# Altium project TEST.PrjPcb
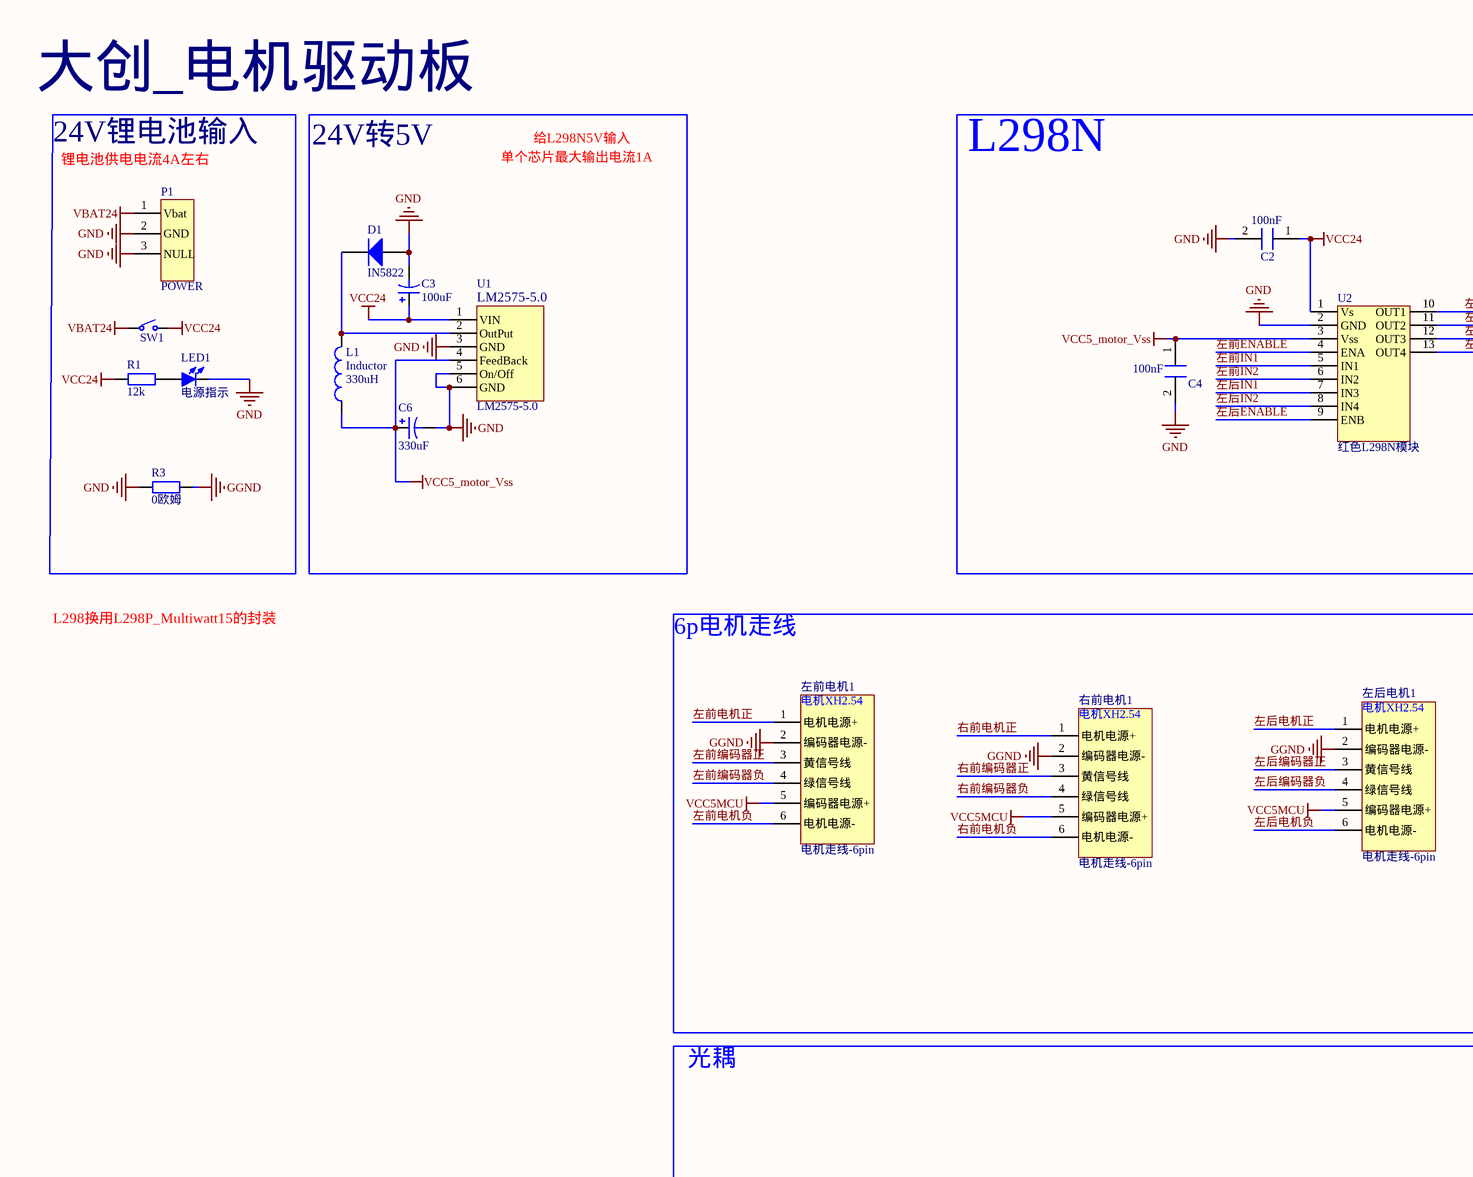
[diagram p0: 大创_电机驱动板原理图.SchDoc, left]
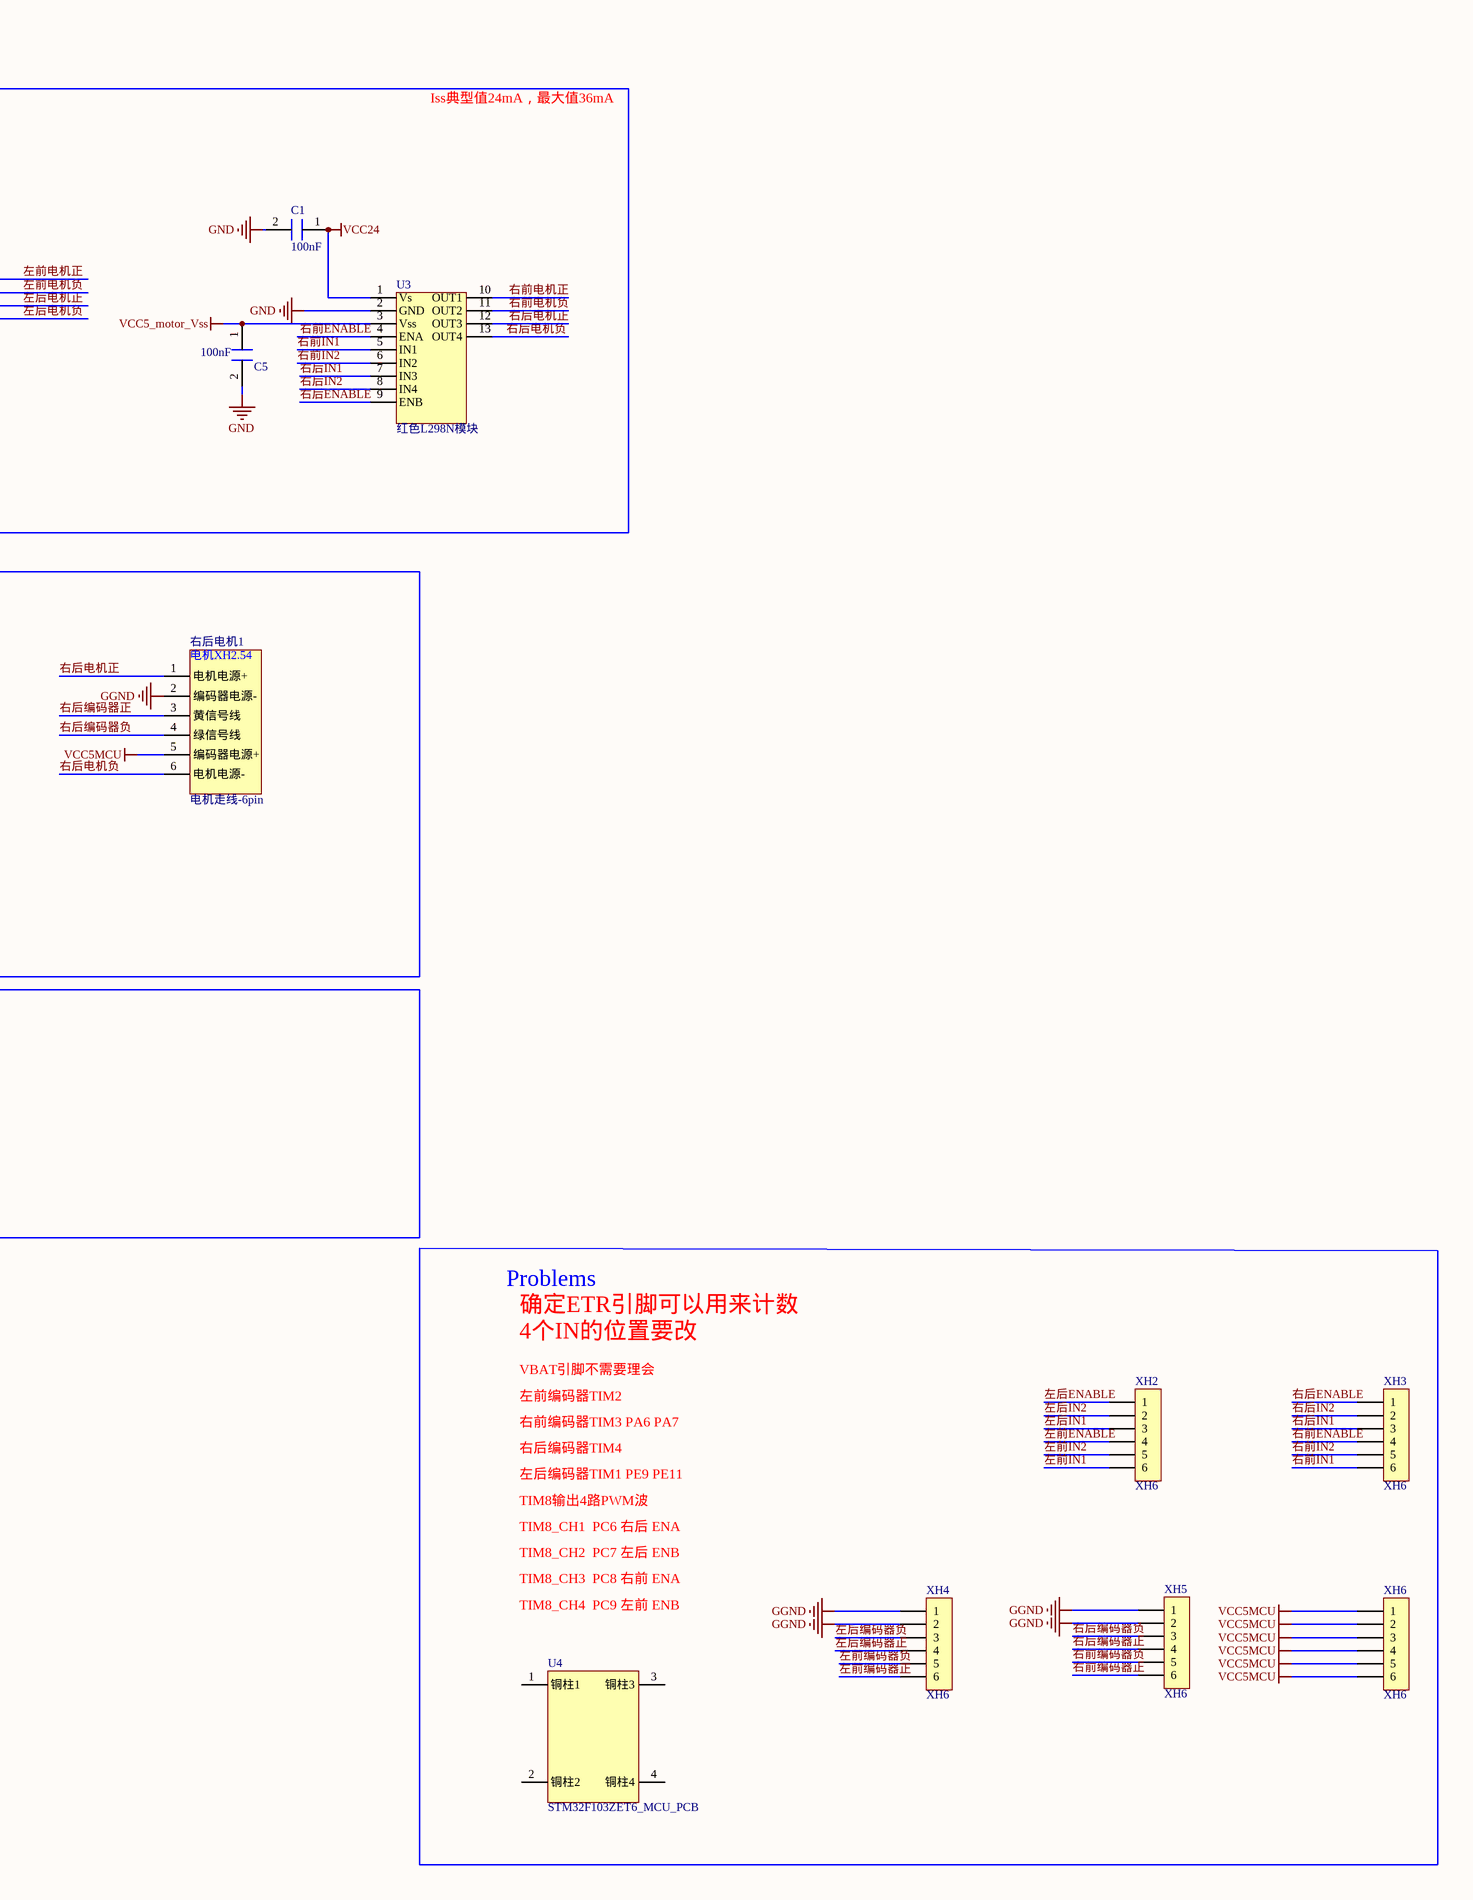
[diagram p1: 大创_电机驱动板原理图.SchDoc, right]
1 sheet, 26 parts. Net scope: global (net labels, ports and power ports of the same name join across sheets).
Board file: 大创_电机驱动底层板.PcbDoc

## Sheet 大创_电机驱动板原理图.SchDoc
size A2

### Parts
C1  100nF  [C 0805_M]
C2  100nF  [C 0805_M]
C3  100uF  [C-引线铝电解电容-6.3*11]
C4  100nF  [C 0805_M]
C5  100nF  [C 0805_M]
C6  value 330uF  [C_引线铝电解电容 10*16]  (hidden comment: 330uF 铝电解)
D1  IN5822  [D_直插_IN5822]
L1  Inductor  value 330uH  [电感(PK0608)]
LED1  电源指示  [LED 0805R]
P1  POWER  [电源插座DC-050-5.5*2.1_贴片]
R1  12k  [R 0805_M]
R3  0欧姆  [R 0805_M]
SW1  (no value)  [蓝色拨码开关_1p]
U1  LM2575-5.0  [TO263-5A]
U2  红色L298N模块  [红色L298N模块]
U3  红色L298N模块  [红色L298N模块]
U4  STM32F103ZET6_MCU_PCB  [STM32F103ZET6_MCU模块]
XH2  XH6  [XH6/2.54mm/90]
XH3  XH6  [XH6/2.54mm/90]
XH4  XH6  [XH6/2.54mm/90]
XH5  XH6  [XH6/2.54mm/90]
XH6  XH6  [XH6/2.54mm/90]
右前电机1  电机走线-6pin  [PH2.0S-6P]
右后电机1  电机走线-6pin  [PH2.0S-6P]
左前电机1  电机走线-6pin  [PH2.0S-6P]
左后电机1  电机走线-6pin  [PH2.0S-6P]

### Blocks framed on the sheet
24V锂电池输入: LED1 P1 R1 R3 SW1
24V转5V: C3 C6 D1 L1 U1
L298N: C1 C2 C4 C5 U2 U3
6p电机走线: 右前电机1 右后电机1 左前电机1 左后电机1

### Nets
GGND: R3.2 XH4.1 XH4.2 XH5.1 XH5.2 右前电机1.2(编码器电源-) 右后电机1.2(编码器电源-) 左前电机1.2(编码器电源-) 左后电机1.2(编码器电源-)
GND: C1.2 C2.2 C3.2 C4.2 C5.2 C6.2 D1.1(A) LED1.2(K) P1.2(GND) P1.3(NULL) R3.1 U1.3(GND) U1.5(On/Off) U1.6(GND) U2.2(GND) U3.2(GND)
VBAT24: P1.1(Vbat) SW1.1
VCC5_motor_Vss: C4.1 C5.1 C6.1 L1.1 U1.4(FeedBack) U2.3(Vss) U3.3(Vss)
VCC5MCU: XH6.1 XH6.2 XH6.3 XH6.4 XH6.5 XH6.6 右前电机1.5(编码器电源+) 右后电机1.5(编码器电源+) 左前电机1.5(编码器电源+) 左后电机1.5(编码器电源+)
VCC24: C1.1 C2.1 C3.1 R1.2 SW1.2 U1.1(VIN) U2.1(Vs) U3.1(Vs)
右前ENABLE: U3.4(ENA) XH3.4
右前IN1: U3.5(IN1) XH3.6
右前IN2: U3.6(IN2) XH3.5
右前电机正: U3.10(OUT1) 右前电机1.1(电机电源+)
右前电机负: U3.11(OUT2) 右前电机1.6(电机电源-)
右前编码器正: XH5.6 右前电机1.3(黄信号线)
右前编码器负: XH5.5 右前电机1.4(绿信号线)
右后ENABLE: U3.9(ENB) XH3.1
右后IN1: U3.7(IN3) XH3.3
右后IN2: U3.8(IN4) XH3.2
右后电机正: U3.12(OUT3) 右后电机1.1(电机电源+)
右后电机负: U3.13(OUT4) 右后电机1.6(电机电源-)
右后编码器正: XH5.4 右后电机1.3(黄信号线)
右后编码器负: XH5.3 右后电机1.4(绿信号线)
左前ENABLE: U2.4(ENA) XH2.4
左前IN1: U2.5(IN1) XH2.6
左前IN2: U2.6(IN2) XH2.5
左前电机正: U2.10(OUT1) 左前电机1.1(电机电源+)
左前电机负: U2.11(OUT2) 左前电机1.6(电机电源-)
左前编码器正: XH4.6 左前电机1.3(黄信号线)
左前编码器负: XH4.5 左前电机1.4(绿信号线)
左后ENABLE: U2.9(ENB) XH2.1
左后IN1: U2.7(IN3) XH2.3
左后IN2: U2.8(IN4) XH2.2
左后电机正: U2.12(OUT3) 左后电机1.1(电机电源+)
左后电机负: U2.13(OUT4) 左后电机1.6(电机电源-)
左后编码器正: XH4.4 左后电机1.3(黄信号线)
左后编码器负: XH4.3 左后电机1.4(绿信号线)
NetD1_2: D1.2(K) L1.2 U1.2(OutPut)
NetLED1_1: LED1.1(A) R1.1

Not connected (* = marked no-connect by the designer): U4 1(铜柱1) 2(铜柱2) 3(铜柱3) 4(铜柱4)

### Notes on the sheet
- 大创_电机驱动板
- (near P1) 锂电池供电电流4A左右
- 单个芯片最大输出电流1A
- 给L298N5V输入
- Iss典型值24mA，最大值36mA
- L298换用L298P_Multiwatt15的封装
- 光耦
- Problems
- 确定ETR引脚可以用来计数
- VBAT引脚不需要理会
- 4个IN的位置要改
- 左前编码器TIM2
- 右前编码器TIM3 PA6 PA7
- 右后编码器TIM4
- 左后编码器TIM1 PE9 PE11
- TIM8输出4路PWM波
- TIM8_CH1  PC6 右后 ENA
- TIM8_CH2  PC7 左后 ENB
- TIM8_CH3  PC8 右前 ENA
- TIM8_CH4  PC9 左前 ENB
- (in symbol 电机走线-6pin) 电机XH2.54

### Library data of the parts
C1 C2 C4 C5 = C0805: 瓷片0805电容
C3 = Cap Pol1: 引线 铝电解电容 100uF 50V; Value: 68uF; Published: 8-Jun-2000; LatestRevisionDate: 17-Jul-2002; LatestRevisionNote: Re-released for DXP Platform.; PackageReference: RB7.6-15; Publisher: Altium Limited; PackageDescription: Polarized Capacitor (Radial); 2 Leads
C6 = Cap Pol1: 50V 330uF 铝电解电容; Published: 8-Jun-2000; LatestRevisionDate: 17-Jul-2002; LatestRevisionNote: Re-released for DXP Platform.; PackageReference: RB7.6-15; Publisher: Altium Limited; PackageDescription: Polarized Capacitor (Radial); 2 Leads
D1 = Diode: 肖特基直插 最大整流3A; Published: 8-Jun-2000; LatestRevisionDate: 17-Jul-2002; LatestRevisionNote: Re-released for DXP Platform.; PackageVersion: Sep-1996; PackageReference: SMC; Publisher: Altium Limited; PackageDescription: DO-214-AB/SMC; 2 C-Bend Leads; Body 7.9 x 5.9 mm, inc. leads (LxW); Code_JEDEC: DO-214-AB
L1 = Inductor: Code_IEC: 1005; Published: 8-Jun-2000; LatestRevisionDate: 29-May-2009; LatestRevisionNote: IPC-7351 Footprint Added.; PackageReference: 0402-A; Publisher: Altium Limited; PackageDescription: Chip Inductor; Code_JEITA: 0402
LED1 = LED-SMD: 贴片LED; 版权归属: 黎明电子style; BOM名称: 贴片LED; 学习资源: https://lmdzstyle.taobao.com/
R1 R3 = R: 贴片电阻; 版权归属: 黎明电子style; BOM名称: 贴片电阻; 学习资源: https://lmdzstyle.taobao.com/
SW1 = TSW 3x6: 船型开关; BOM名称: 3x6轻触开关; 版权归属: 黎明电子style; 学习资源: https://lmdzstyle.taobao.com/
U1 = LM2575-5.0: 降压芯片